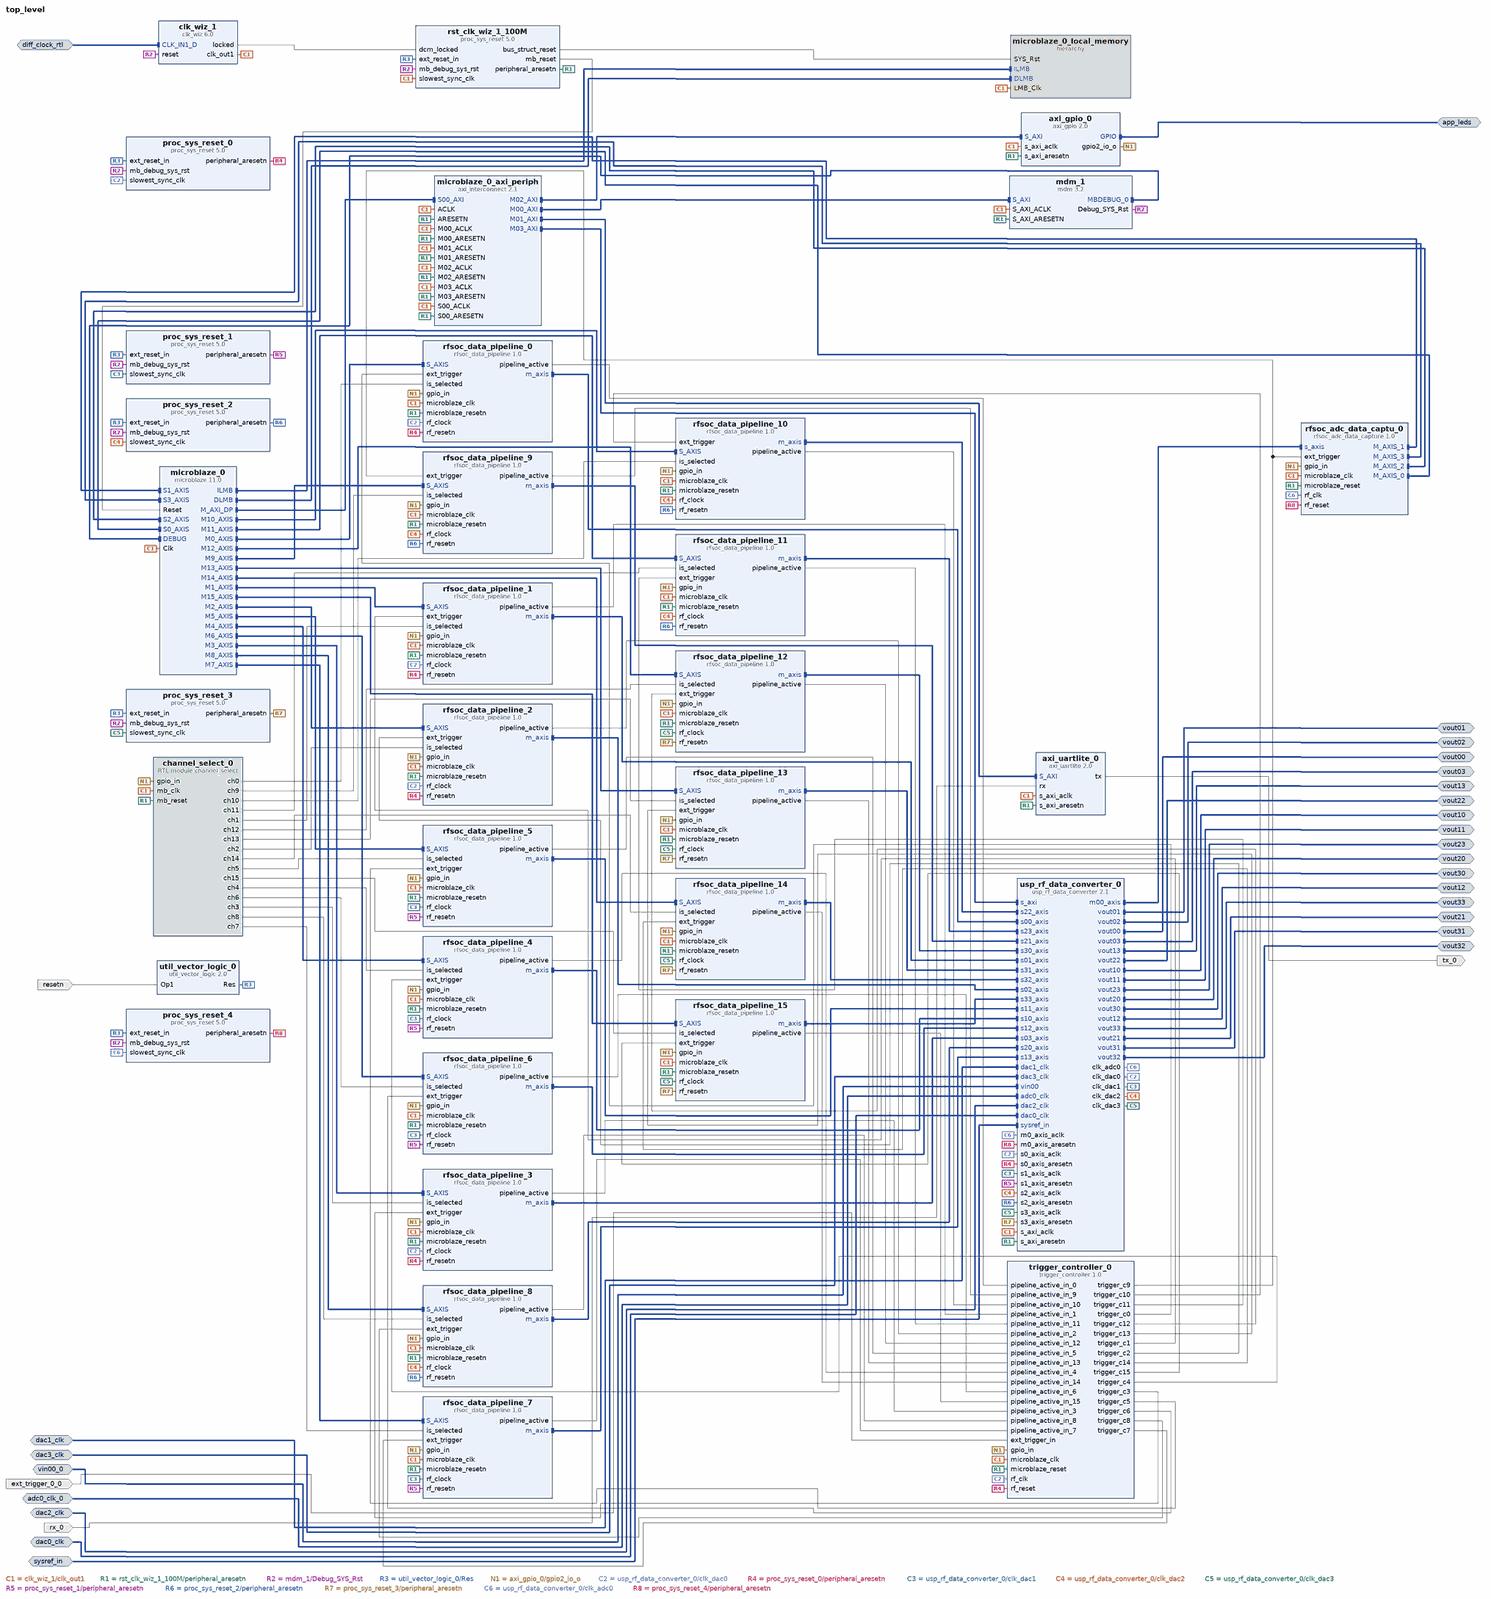
[diagram p0: block diagram of the top level, whole]
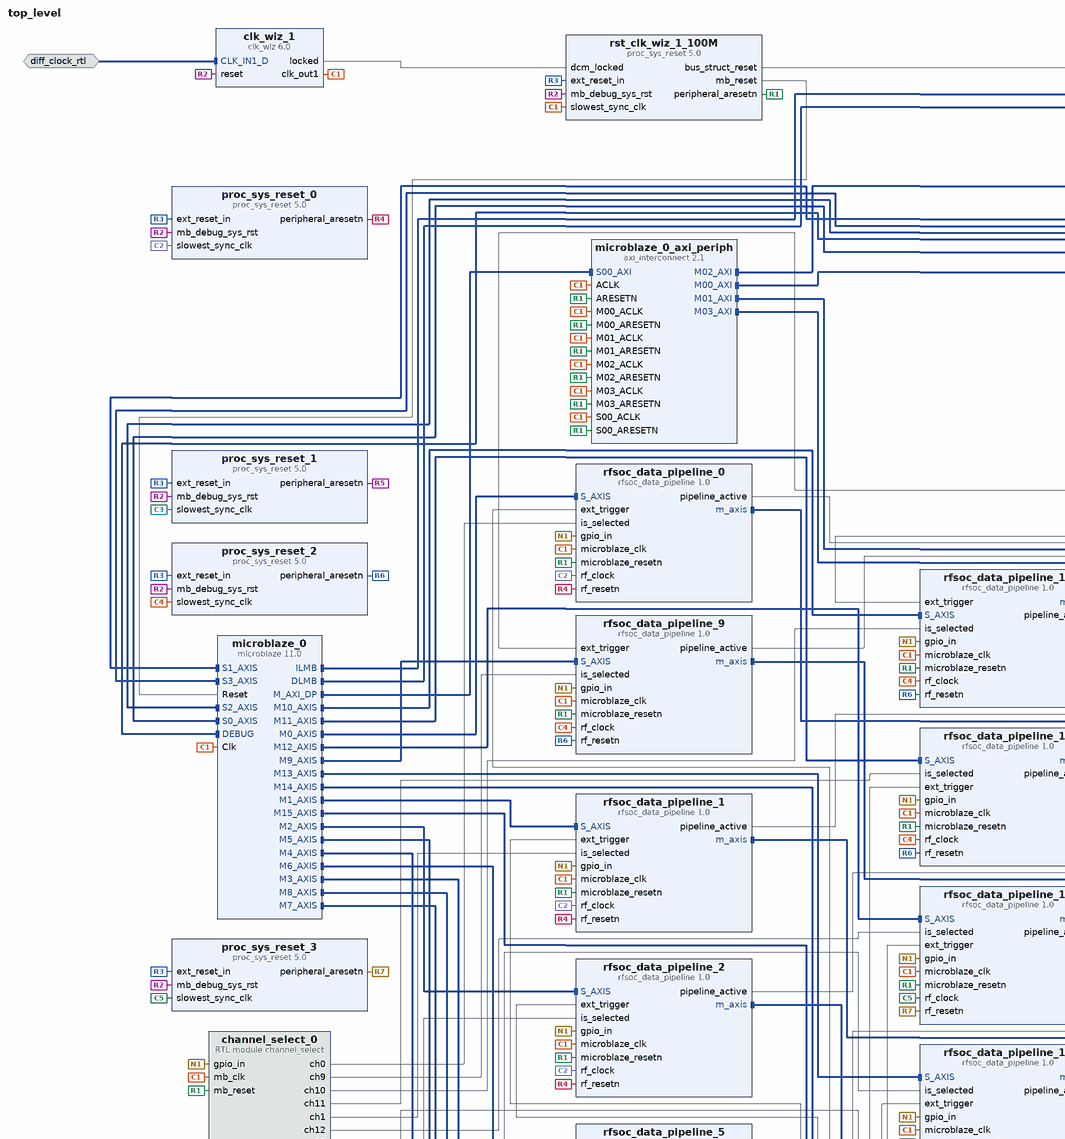
[diagram p1: block diagram of the top level, upper left part]
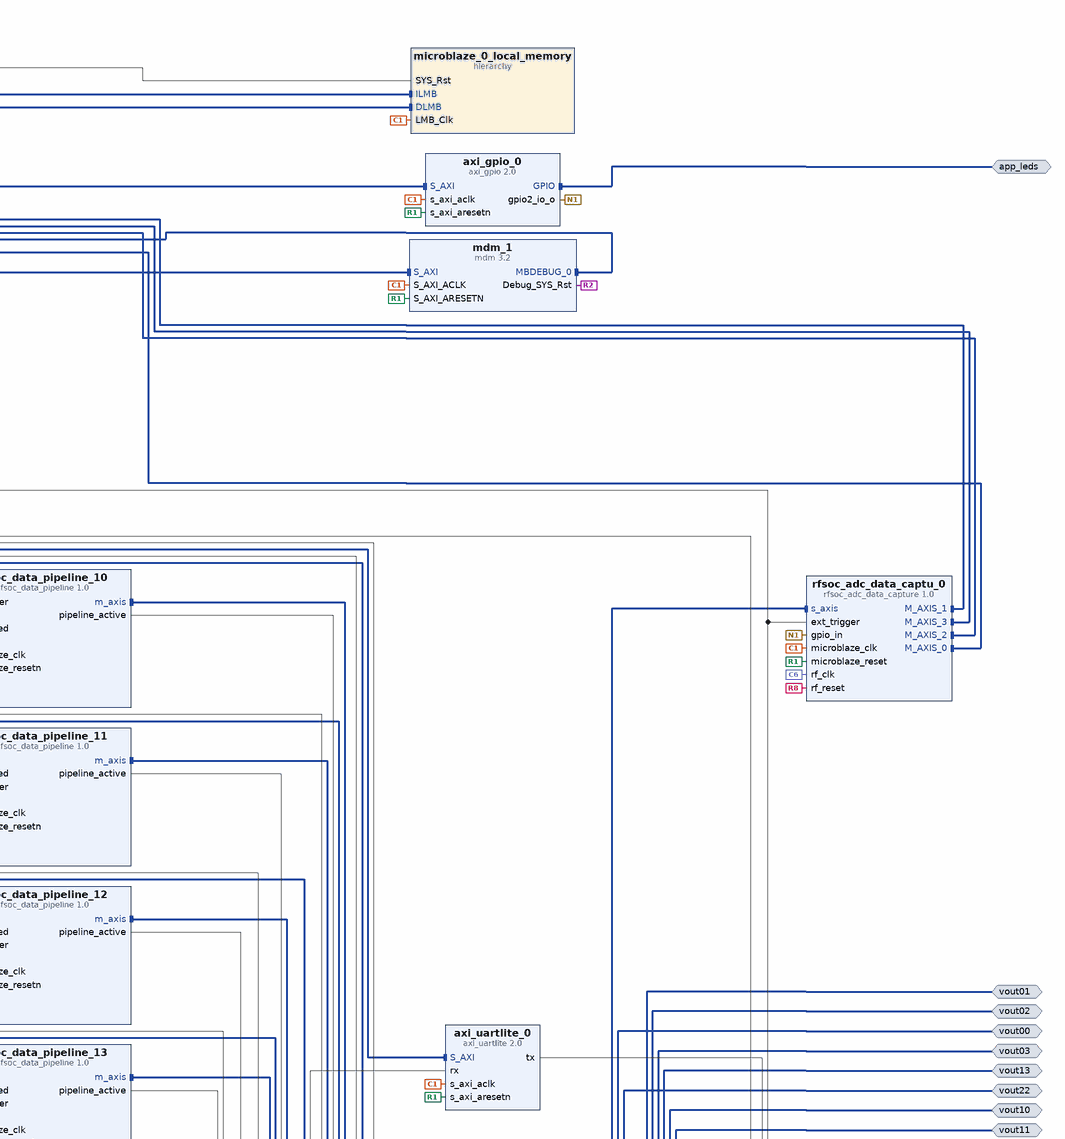
[diagram p2: block diagram of the top level, upper right part]
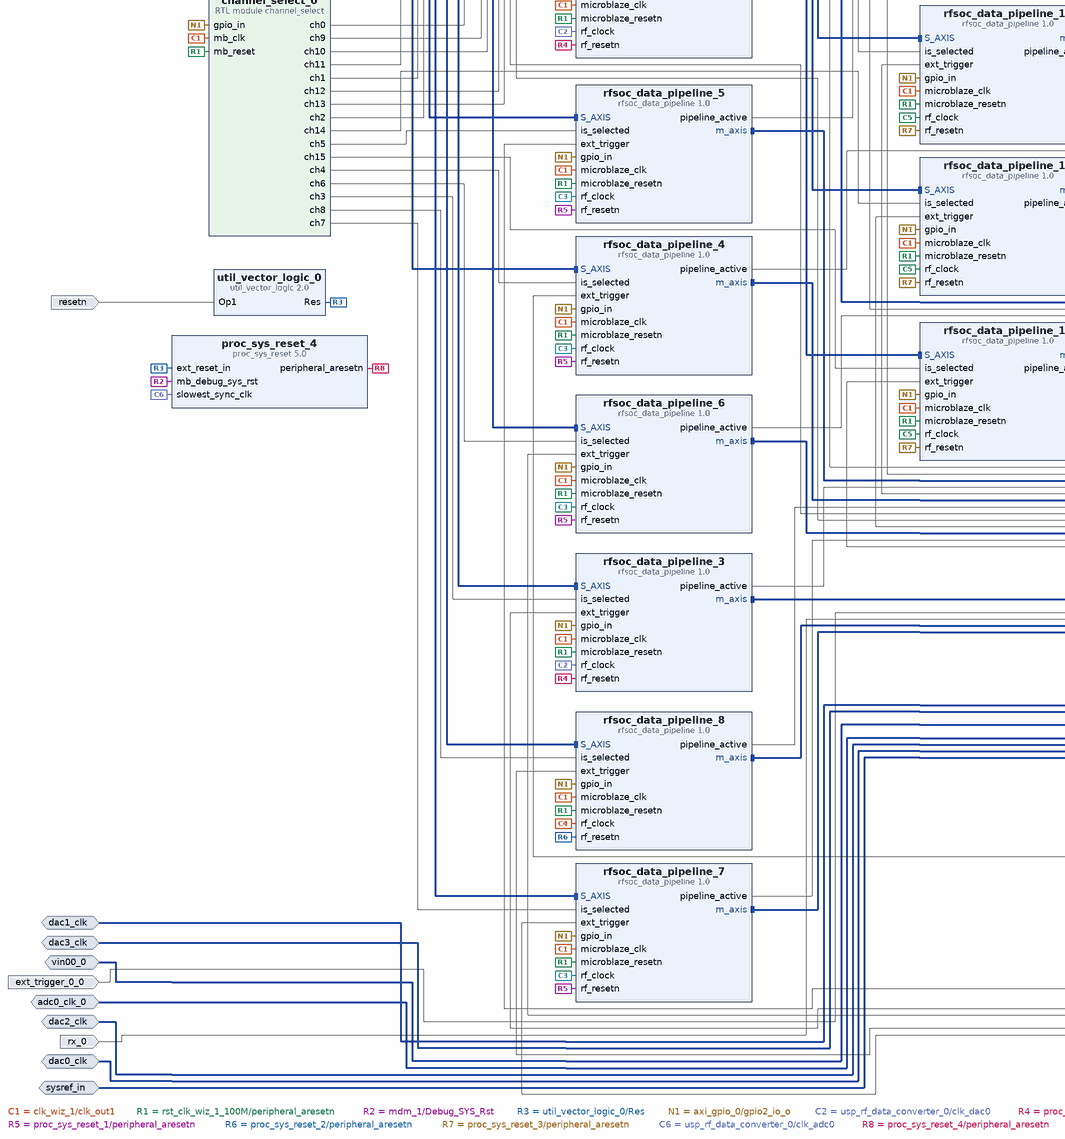
[diagram p3: block diagram of the top level, lower left part]
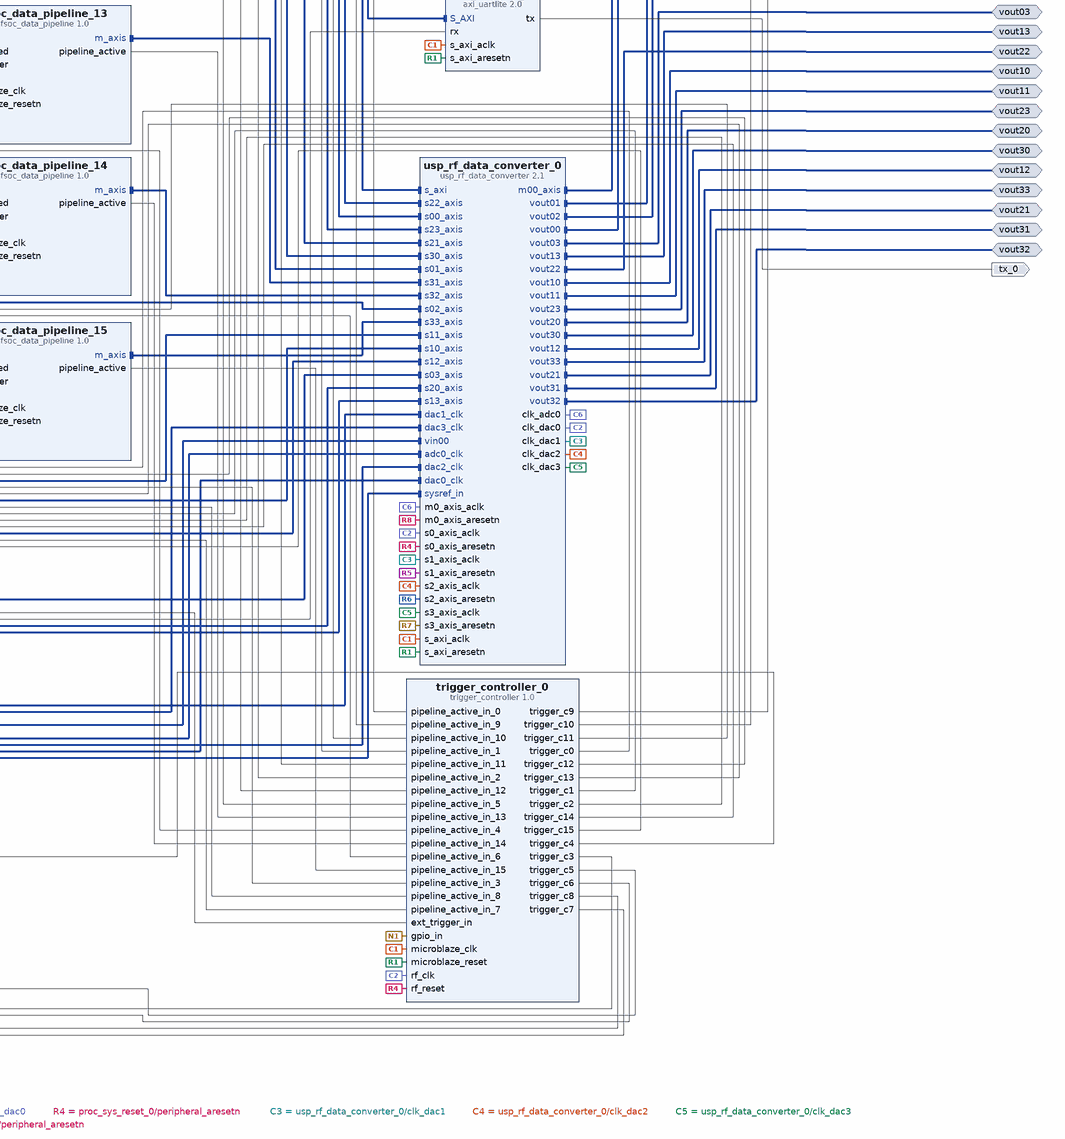
[diagram p4: block diagram of the top level, lower right part]
# Vivado block design top_level, xczu29dr-ffvf1760-2-e, Vivado 2019.1
create_bd_design top_level

create_bd_intf_port -mode Slave -vlnv xilinx.com:interface:diff_clock_rtl:1.0 diff_clock_rtl
set_property -dict {CONFIG.FREQ_HZ 300000000} [get_bd_intf_ports diff_clock_rtl]
create_bd_intf_port -mode Slave -vlnv xilinx.com:display_usp_rf_data_converter:diff_pins_rtl:1.0 sysref_in
create_bd_intf_port -mode Slave -vlnv xilinx.com:interface:diff_clock_rtl:1.0 dac0_clk
set_property -dict {CONFIG.FREQ_HZ 4000000000.0} [get_bd_intf_ports dac0_clk]
create_bd_intf_port -mode Master -vlnv xilinx.com:interface:diff_analog_io_rtl:1.0 vout00
create_bd_intf_port -mode Master -vlnv xilinx.com:interface:diff_analog_io_rtl:1.0 vout01
create_bd_intf_port -mode Master -vlnv xilinx.com:interface:diff_analog_io_rtl:1.0 vout02
create_bd_intf_port -mode Master -vlnv xilinx.com:interface:diff_analog_io_rtl:1.0 vout03
create_bd_intf_port -mode Master -vlnv xilinx.com:interface:gpio_rtl:1.0 app_leds
create_bd_intf_port -mode Slave -vlnv xilinx.com:interface:diff_clock_rtl:1.0 dac1_clk
set_property -dict {CONFIG.FREQ_HZ 250000000.0} [get_bd_intf_ports dac1_clk]
create_bd_intf_port -mode Master -vlnv xilinx.com:interface:diff_analog_io_rtl:1.0 vout10
create_bd_intf_port -mode Master -vlnv xilinx.com:interface:diff_analog_io_rtl:1.0 vout11
create_bd_intf_port -mode Master -vlnv xilinx.com:interface:diff_analog_io_rtl:1.0 vout12
create_bd_intf_port -mode Master -vlnv xilinx.com:interface:diff_analog_io_rtl:1.0 vout13
create_bd_intf_port -mode Slave -vlnv xilinx.com:interface:diff_clock_rtl:1.0 dac2_clk
set_property -dict {CONFIG.FREQ_HZ 250000000.0} [get_bd_intf_ports dac2_clk]
create_bd_intf_port -mode Master -vlnv xilinx.com:interface:diff_analog_io_rtl:1.0 vout20
create_bd_intf_port -mode Master -vlnv xilinx.com:interface:diff_analog_io_rtl:1.0 vout21
create_bd_intf_port -mode Master -vlnv xilinx.com:interface:diff_analog_io_rtl:1.0 vout22
create_bd_intf_port -mode Master -vlnv xilinx.com:interface:diff_analog_io_rtl:1.0 vout23
create_bd_intf_port -mode Slave -vlnv xilinx.com:interface:diff_clock_rtl:1.0 dac3_clk
set_property -dict {CONFIG.FREQ_HZ 250000000.0} [get_bd_intf_ports dac3_clk]
create_bd_intf_port -mode Master -vlnv xilinx.com:interface:diff_analog_io_rtl:1.0 vout30
create_bd_intf_port -mode Master -vlnv xilinx.com:interface:diff_analog_io_rtl:1.0 vout31
create_bd_intf_port -mode Master -vlnv xilinx.com:interface:diff_analog_io_rtl:1.0 vout32
create_bd_intf_port -mode Master -vlnv xilinx.com:interface:diff_analog_io_rtl:1.0 vout33
create_bd_intf_port -mode Slave -vlnv xilinx.com:interface:diff_analog_io_rtl:1.0 vin00_0
create_bd_intf_port -mode Slave -vlnv xilinx.com:interface:diff_clock_rtl:1.0 adc0_clk_0
create_bd_port -dir I -type rst resetn
set_property -dict {CONFIG.POLARITY ACTIVE_HIGH} [get_bd_ports resetn]
create_bd_port -dir I rx_0
create_bd_port -dir O tx_0
create_bd_port -dir I ext_trigger_0_0

create_bd_cell -type ip -vlnv xilinx.com:ip:microblaze:11.0 microblaze_0
set_property -dict [list \
  CONFIG.C_DEBUG_ENABLED 1 \
  CONFIG.C_D_AXI 1 \
  CONFIG.C_D_LMB 1 \
  CONFIG.C_FSL_LINKS 16 \
  CONFIG.C_I_LMB 1 \
  CONFIG.C_USE_EXTENDED_FSL_INSTR 1 \
] [get_bd_cells microblaze_0]
create_bd_cell -type hier microblaze_0_local_memory
create_bd_cell -type ip -vlnv xilinx.com:ip:axi_interconnect:2.1 microblaze_0_axi_periph
set_property -dict {CONFIG.NUM_MI 4} [get_bd_cells microblaze_0_axi_periph]
create_bd_cell -type ip -vlnv xilinx.com:ip:mdm:3.2 mdm_1
set_property -dict {CONFIG.C_ADDR_SIZE 32 CONFIG.C_M_AXI_ADDR_WIDTH 32 CONFIG.C_USE_UART 1} [get_bd_cells mdm_1]
create_bd_cell -type ip -vlnv xilinx.com:ip:clk_wiz:6.0 clk_wiz_1
set_property -dict [list \
  CONFIG.CLKIN1_JITTER_PS 33.330000000000005 \
  CONFIG.CLKOUT1_JITTER 101.475 \
  CONFIG.CLKOUT1_PHASE_ERROR 77.836 \
  CONFIG.MMCM_CLKFBOUT_MULT_F 4.000 \
  CONFIG.MMCM_CLKIN1_PERIOD 3.333 \
  CONFIG.MMCM_CLKIN2_PERIOD 10.0 \
  CONFIG.PRIM_IN_FREQ 300.000 \
  CONFIG.PRIM_SOURCE Differential_clock_capable_pin \
  CONFIG.USE_LOCKED true \
] [get_bd_cells clk_wiz_1]
create_bd_cell -type ip -vlnv xilinx.com:ip:proc_sys_reset:5.0 rst_clk_wiz_1_100M
create_bd_cell -type ip -vlnv xilinx.com:ip:util_vector_logic:2.0 util_vector_logic_0
set_property -dict {CONFIG.C_OPERATION not CONFIG.C_SIZE 1} [get_bd_cells util_vector_logic_0]
create_bd_cell -type ip -vlnv xilinx.com:ip:axi_uartlite:2.0 axi_uartlite_0
set_property -dict {CONFIG.C_BAUDRATE 230400} [get_bd_cells axi_uartlite_0]
create_bd_cell -type ip -vlnv xilinx.com:ip:axi_gpio:2.0 axi_gpio_0
set_property -dict [list \
  CONFIG.C_ALL_OUTPUTS_2 1 \
  CONFIG.C_GPIO2_WIDTH 16 \
  CONFIG.C_IS_DUAL 1 \
  CONFIG.GPIO2_BOARD_INTERFACE Custom \
  CONFIG.GPIO_BOARD_INTERFACE app_leds \
  CONFIG.USE_BOARD_FLOW true \
] [get_bd_cells axi_gpio_0]
create_bd_cell -type ip -vlnv xilinx.com:ip:usp_rf_data_converter:2.1 usp_rf_data_converter_0
set_property -dict [list \
  CONFIG.ADC0_PLL_Enable true \
  CONFIG.ADC0_Refclk_Freq 250.000 \
  CONFIG.ADC_Decimation_Mode00 1 \
  CONFIG.ADC_Dither00 true \
  CONFIG.ADC_Mixer_Type00 0 \
  CONFIG.ADC_Slice00_Enable true \
  CONFIG.DAC0_Outclk_Freq 250.000 \
  CONFIG.DAC0_PLL_Enable true \
  CONFIG.DAC0_Refclk_Freq 250.000 \
  CONFIG.DAC0_Sampling_Rate 4 \
  CONFIG.DAC1_Outclk_Freq 250.000 \
  CONFIG.DAC1_PLL_Enable true \
  CONFIG.DAC1_Refclk_Freq 250.000 \
  CONFIG.DAC1_Sampling_Rate 4 \
  CONFIG.DAC2_Outclk_Freq 250.000 \
  CONFIG.DAC2_PLL_Enable true \
  CONFIG.DAC2_Refclk_Freq 250.000 \
  CONFIG.DAC2_Sampling_Rate 4 \
  CONFIG.DAC3_Outclk_Freq 250.000 \
  CONFIG.DAC3_PLL_Enable true \
  CONFIG.DAC3_Refclk_Freq 250.000 \
  CONFIG.DAC3_Sampling_Rate 4 \
  CONFIG.DAC_Interpolation_Mode00 1 \
  CONFIG.DAC_Interpolation_Mode01 1 \
  CONFIG.DAC_Interpolation_Mode02 1 \
  CONFIG.DAC_Interpolation_Mode03 1 \
  CONFIG.DAC_Interpolation_Mode10 1 \
  CONFIG.DAC_Interpolation_Mode11 1 \
  CONFIG.DAC_Interpolation_Mode12 1 \
  CONFIG.DAC_Interpolation_Mode13 1 \
  CONFIG.DAC_Interpolation_Mode20 1 \
  CONFIG.DAC_Interpolation_Mode21 1 \
  CONFIG.DAC_Interpolation_Mode22 1 \
  CONFIG.DAC_Interpolation_Mode23 1 \
  CONFIG.DAC_Interpolation_Mode30 1 \
  CONFIG.DAC_Interpolation_Mode31 1 \
  CONFIG.DAC_Interpolation_Mode32 1 \
  CONFIG.DAC_Interpolation_Mode33 1 \
  CONFIG.DAC_Mixer_Type00 0 \
  CONFIG.DAC_Mixer_Type01 0 \
  CONFIG.DAC_Mixer_Type02 0 \
  CONFIG.DAC_Mixer_Type03 0 \
  CONFIG.DAC_Mixer_Type10 0 \
  CONFIG.DAC_Mixer_Type11 0 \
  CONFIG.DAC_Mixer_Type12 0 \
  CONFIG.DAC_Mixer_Type13 0 \
  CONFIG.DAC_Mixer_Type20 0 \
  CONFIG.DAC_Mixer_Type21 0 \
  CONFIG.DAC_Mixer_Type22 0 \
  CONFIG.DAC_Mixer_Type23 0 \
  CONFIG.DAC_Mixer_Type30 0 \
  CONFIG.DAC_Mixer_Type31 0 \
  CONFIG.DAC_Mixer_Type32 0 \
  CONFIG.DAC_Mixer_Type33 0 \
  CONFIG.DAC_Output_Current 1 \
  CONFIG.DAC_Slice00_Enable true \
  CONFIG.DAC_Slice01_Enable true \
  CONFIG.DAC_Slice02_Enable true \
  CONFIG.DAC_Slice03_Enable true \
  CONFIG.DAC_Slice10_Enable true \
  CONFIG.DAC_Slice11_Enable true \
  CONFIG.DAC_Slice12_Enable true \
  CONFIG.DAC_Slice13_Enable true \
  CONFIG.DAC_Slice20_Enable true \
  CONFIG.DAC_Slice21_Enable true \
  CONFIG.DAC_Slice22_Enable true \
  CONFIG.DAC_Slice23_Enable true \
  CONFIG.DAC_Slice30_Enable true \
  CONFIG.DAC_Slice31_Enable true \
  CONFIG.DAC_Slice32_Enable true \
  CONFIG.DAC_Slice33_Enable true \
] [get_bd_cells usp_rf_data_converter_0]
create_bd_cell -type ip -vlnv xilinx.com:ip:proc_sys_reset:5.0 proc_sys_reset_0
create_bd_cell -type ip -vlnv xilinx.com:ip:proc_sys_reset:5.0 proc_sys_reset_1
create_bd_cell -type ip -vlnv xilinx.com:ip:proc_sys_reset:5.0 proc_sys_reset_2
create_bd_cell -type ip -vlnv xilinx.com:ip:proc_sys_reset:5.0 proc_sys_reset_3
create_bd_cell -type ip -vlnv xilinx.com:ip:proc_sys_reset:5.0 proc_sys_reset_4
create_bd_cell -type module -reference channel_select channel_select_0
create_bd_cell -type ip -vlnv xilinx.com:user:rfsoc_data_pipeline:1.0 rfsoc_data_pipeline_0
create_bd_cell -type ip -vlnv xilinx.com:user:rfsoc_data_pipeline:1.0 rfsoc_data_pipeline_10
create_bd_cell -type ip -vlnv xilinx.com:user:rfsoc_data_pipeline:1.0 rfsoc_data_pipeline_11
create_bd_cell -type ip -vlnv xilinx.com:user:rfsoc_data_pipeline:1.0 rfsoc_data_pipeline_12
create_bd_cell -type ip -vlnv xilinx.com:user:rfsoc_data_pipeline:1.0 rfsoc_data_pipeline_13
create_bd_cell -type ip -vlnv xilinx.com:user:rfsoc_data_pipeline:1.0 rfsoc_data_pipeline_14
create_bd_cell -type ip -vlnv xilinx.com:user:rfsoc_data_pipeline:1.0 rfsoc_data_pipeline_15
create_bd_cell -type ip -vlnv xilinx.com:user:rfsoc_data_pipeline:1.0 rfsoc_data_pipeline_1
create_bd_cell -type ip -vlnv xilinx.com:user:rfsoc_data_pipeline:1.0 rfsoc_data_pipeline_2
create_bd_cell -type ip -vlnv xilinx.com:user:rfsoc_data_pipeline:1.0 rfsoc_data_pipeline_3
create_bd_cell -type ip -vlnv xilinx.com:user:rfsoc_data_pipeline:1.0 rfsoc_data_pipeline_4
create_bd_cell -type ip -vlnv xilinx.com:user:rfsoc_data_pipeline:1.0 rfsoc_data_pipeline_5
create_bd_cell -type ip -vlnv xilinx.com:user:rfsoc_data_pipeline:1.0 rfsoc_data_pipeline_6
create_bd_cell -type ip -vlnv xilinx.com:user:rfsoc_data_pipeline:1.0 rfsoc_data_pipeline_7
create_bd_cell -type ip -vlnv xilinx.com:user:rfsoc_data_pipeline:1.0 rfsoc_data_pipeline_8
create_bd_cell -type ip -vlnv xilinx.com:user:rfsoc_data_pipeline:1.0 rfsoc_data_pipeline_9
create_bd_cell -type ip -vlnv xilinx.com:user:trigger_controller:1.0 trigger_controller_0
create_bd_cell -type ip -vlnv xilinx.com:user:rfsoc_adc_data_capture:1.0 rfsoc_adc_data_captu_0

# ---- hierarchy /microblaze_0_local_memory ----
current_bd_instance /microblaze_0_local_memory
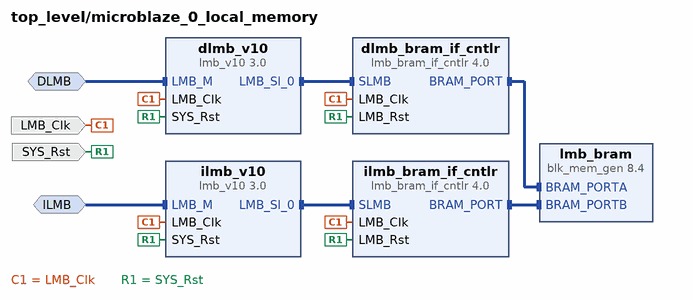
[diagram p5: block diagram inside /microblaze_0_local_memory]
create_bd_intf_pin -mode MirroredMaster -vlnv xilinx.com:interface:lmb_rtl:1.0 DLMB
create_bd_intf_pin -mode MirroredMaster -vlnv xilinx.com:interface:lmb_rtl:1.0 ILMB
create_bd_pin -dir I -type clk LMB_Clk
create_bd_pin -dir I -type rst SYS_Rst

create_bd_cell -type ip -vlnv xilinx.com:ip:lmb_v10:3.0 dlmb_v10
create_bd_cell -type ip -vlnv xilinx.com:ip:lmb_v10:3.0 ilmb_v10
create_bd_cell -type ip -vlnv xilinx.com:ip:lmb_bram_if_cntlr:4.0 dlmb_bram_if_cntlr
set_property -dict {CONFIG.C_ECC 0} [get_bd_cells dlmb_bram_if_cntlr]
create_bd_cell -type ip -vlnv xilinx.com:ip:lmb_bram_if_cntlr:4.0 ilmb_bram_if_cntlr
set_property -dict {CONFIG.C_ECC 0} [get_bd_cells ilmb_bram_if_cntlr]
create_bd_cell -type ip -vlnv xilinx.com:ip:blk_mem_gen:8.4 lmb_bram
set_property -dict {CONFIG.Memory_Type True_Dual_Port_RAM CONFIG.use_bram_block BRAM_Controller} [get_bd_cells lmb_bram]

# ---- connections ----

current_bd_instance /microblaze_0_local_memory
connect_bd_intf_net -intf_net microblaze_0_dlmb [get_bd_intf_pins DLMB] [get_bd_intf_pins dlmb_v10/LMB_M]
connect_bd_intf_net -intf_net microblaze_0_ilmb [get_bd_intf_pins ILMB] [get_bd_intf_pins ilmb_v10/LMB_M]
connect_bd_intf_net -intf_net microblaze_0_dlmb_bus [get_bd_intf_pins dlmb_v10/LMB_Sl_0] [get_bd_intf_pins dlmb_bram_if_cntlr/SLMB]
connect_bd_intf_net -intf_net microblaze_0_ilmb_bus [get_bd_intf_pins ilmb_v10/LMB_Sl_0] [get_bd_intf_pins ilmb_bram_if_cntlr/SLMB]
connect_bd_intf_net -intf_net microblaze_0_ilmb_cntlr [get_bd_intf_pins ilmb_bram_if_cntlr/BRAM_PORT] [get_bd_intf_pins lmb_bram/BRAM_PORTB]
connect_bd_intf_net -intf_net microblaze_0_dlmb_cntlr [get_bd_intf_pins dlmb_bram_if_cntlr/BRAM_PORT] [get_bd_intf_pins lmb_bram/BRAM_PORTA]
connect_bd_net -net microblaze_0_Clk [get_bd_pins LMB_Clk] \
  [get_bd_pins dlmb_v10/LMB_Clk] [get_bd_pins dlmb_bram_if_cntlr/LMB_Clk] [get_bd_pins ilmb_v10/LMB_Clk] \
  [get_bd_pins ilmb_bram_if_cntlr/LMB_Clk]
connect_bd_net [get_bd_pins SYS_Rst] \
  [get_bd_pins dlmb_v10/SYS_Rst] [get_bd_pins dlmb_bram_if_cntlr/LMB_Rst] [get_bd_pins ilmb_v10/SYS_Rst] \
  [get_bd_pins ilmb_bram_if_cntlr/LMB_Rst]
set_property HDL_ATTRIBUTE.BMM_INFO_ADDRESS_SPACE {byte  0x00000000 32 > top_level microblaze_0_local_memory/lmb_bram} [get_bd_cells dlmb_bram_if_cntlr]
set_property HDL_ATTRIBUTE.KEEP_HIERARCHY yes [get_bd_cells dlmb_bram_if_cntlr]

current_bd_instance /
connect_bd_intf_net [get_bd_intf_ports vout22] [get_bd_intf_pins usp_rf_data_converter_0/vout22]
connect_bd_intf_net [get_bd_intf_pins microblaze_0/M10_AXIS] [get_bd_intf_pins rfsoc_data_pipeline_10/S_AXIS]
connect_bd_intf_net [get_bd_intf_pins rfsoc_data_pipeline_7/S_AXIS] [get_bd_intf_pins microblaze_0/M7_AXIS]
connect_bd_intf_net [get_bd_intf_pins microblaze_0/ILMB] [get_bd_intf_pins microblaze_0_local_memory/ILMB]
connect_bd_intf_net [get_bd_intf_ports dac1_clk] [get_bd_intf_pins usp_rf_data_converter_0/dac1_clk]
connect_bd_intf_net [get_bd_intf_pins rfsoc_data_pipeline_0/m_axis] [get_bd_intf_pins usp_rf_data_converter_0/s00_axis]
connect_bd_intf_net [get_bd_intf_ports vout02] [get_bd_intf_pins usp_rf_data_converter_0/vout02]
connect_bd_intf_net [get_bd_intf_ports vout01] [get_bd_intf_pins usp_rf_data_converter_0/vout01]
connect_bd_intf_net [get_bd_intf_pins microblaze_0/M9_AXIS] [get_bd_intf_pins rfsoc_data_pipeline_9/S_AXIS]
connect_bd_intf_net [get_bd_intf_pins rfsoc_data_pipeline_14/S_AXIS] [get_bd_intf_pins microblaze_0/M14_AXIS]
connect_bd_intf_net [get_bd_intf_pins microblaze_0/M1_AXIS] [get_bd_intf_pins rfsoc_data_pipeline_1/S_AXIS]
connect_bd_intf_net [get_bd_intf_pins microblaze_0/DLMB] [get_bd_intf_pins microblaze_0_local_memory/DLMB]
connect_bd_intf_net [get_bd_intf_ports dac3_clk] [get_bd_intf_pins usp_rf_data_converter_0/dac3_clk]
connect_bd_intf_net [get_bd_intf_pins rfsoc_data_pipeline_1/m_axis] [get_bd_intf_pins usp_rf_data_converter_0/s01_axis]
connect_bd_intf_net [get_bd_intf_pins rfsoc_data_pipeline_15/S_AXIS] [get_bd_intf_pins microblaze_0/M15_AXIS]
connect_bd_intf_net -intf_net vin00_0_1 [get_bd_intf_ports vin00_0] [get_bd_intf_pins usp_rf_data_converter_0/vin00]
connect_bd_intf_net [get_bd_intf_pins microblaze_0_axi_periph/M02_AXI] [get_bd_intf_pins axi_gpio_0/S_AXI]
connect_bd_intf_net [get_bd_intf_pins rfsoc_data_pipeline_13/m_axis] [get_bd_intf_pins usp_rf_data_converter_0/s31_axis]
connect_bd_intf_net [get_bd_intf_pins rfsoc_data_pipeline_6/m_axis] [get_bd_intf_pins usp_rf_data_converter_0/s12_axis]
connect_bd_intf_net [get_bd_intf_ports vout13] [get_bd_intf_pins usp_rf_data_converter_0/vout13]
connect_bd_intf_net -intf_net adc0_clk_0_1 [get_bd_intf_ports adc0_clk_0] [get_bd_intf_pins usp_rf_data_converter_0/adc0_clk]
connect_bd_intf_net [get_bd_intf_pins rfsoc_adc_data_captu_0/M_AXIS_1] [get_bd_intf_pins microblaze_0/S1_AXIS]
connect_bd_intf_net [get_bd_intf_pins rfsoc_data_pipeline_12/m_axis] [get_bd_intf_pins usp_rf_data_converter_0/s30_axis]
connect_bd_intf_net -intf_net microblaze_0_axi_dp [get_bd_intf_pins microblaze_0_axi_periph/S00_AXI] [get_bd_intf_pins microblaze_0/M_AXI_DP]
connect_bd_intf_net [get_bd_intf_ports vout23] [get_bd_intf_pins usp_rf_data_converter_0/vout23]
connect_bd_intf_net [get_bd_intf_ports vout03] [get_bd_intf_pins usp_rf_data_converter_0/vout03]
connect_bd_intf_net [get_bd_intf_pins microblaze_0/M6_AXIS] [get_bd_intf_pins rfsoc_data_pipeline_6/S_AXIS]
connect_bd_intf_net [get_bd_intf_pins microblaze_0/M12_AXIS] [get_bd_intf_pins rfsoc_data_pipeline_12/S_AXIS]
connect_bd_intf_net [get_bd_intf_pins rfsoc_data_pipeline_5/m_axis] [get_bd_intf_pins usp_rf_data_converter_0/s11_axis]
connect_bd_intf_net [get_bd_intf_ports vout30] [get_bd_intf_pins usp_rf_data_converter_0/vout30]
connect_bd_intf_net [get_bd_intf_pins microblaze_0_axi_periph/M03_AXI] [get_bd_intf_pins usp_rf_data_converter_0/s_axi]
connect_bd_intf_net [get_bd_intf_ports dac2_clk] [get_bd_intf_pins usp_rf_data_converter_0/dac2_clk]
connect_bd_intf_net [get_bd_intf_pins rfsoc_data_pipeline_10/m_axis] [get_bd_intf_pins usp_rf_data_converter_0/s22_axis]
connect_bd_intf_net [get_bd_intf_ports dac0_clk] [get_bd_intf_pins usp_rf_data_converter_0/dac0_clk]
connect_bd_intf_net [get_bd_intf_pins microblaze_0/M11_AXIS] [get_bd_intf_pins rfsoc_data_pipeline_11/S_AXIS]
connect_bd_intf_net [get_bd_intf_pins rfsoc_adc_data_captu_0/M_AXIS_3] [get_bd_intf_pins microblaze_0/S3_AXIS]
connect_bd_intf_net [get_bd_intf_ports vout33] [get_bd_intf_pins usp_rf_data_converter_0/vout33]
connect_bd_intf_net [get_bd_intf_pins microblaze_0/M13_AXIS] [get_bd_intf_pins rfsoc_data_pipeline_13/S_AXIS]
connect_bd_intf_net [get_bd_intf_pins rfsoc_data_pipeline_15/m_axis] [get_bd_intf_pins usp_rf_data_converter_0/s33_axis]
connect_bd_intf_net [get_bd_intf_pins rfsoc_data_pipeline_5/S_AXIS] [get_bd_intf_pins microblaze_0/M5_AXIS]
connect_bd_intf_net [get_bd_intf_pins rfsoc_data_pipeline_11/m_axis] [get_bd_intf_pins usp_rf_data_converter_0/s23_axis]
connect_bd_intf_net [get_bd_intf_pins rfsoc_data_pipeline_14/m_axis] [get_bd_intf_pins usp_rf_data_converter_0/s32_axis]
connect_bd_intf_net [get_bd_intf_ports diff_clock_rtl] [get_bd_intf_pins clk_wiz_1/CLK_IN1_D]
connect_bd_intf_net [get_bd_intf_pins microblaze_0/M2_AXIS] [get_bd_intf_pins rfsoc_data_pipeline_2/S_AXIS]
connect_bd_intf_net [get_bd_intf_pins rfsoc_data_pipeline_4/S_AXIS] [get_bd_intf_pins microblaze_0/M4_AXIS]
connect_bd_intf_net [get_bd_intf_pins rfsoc_data_pipeline_8/m_axis] [get_bd_intf_pins usp_rf_data_converter_0/s20_axis]
connect_bd_intf_net [get_bd_intf_ports vout00] [get_bd_intf_pins usp_rf_data_converter_0/vout00]
connect_bd_intf_net [get_bd_intf_pins microblaze_0/M0_AXIS] [get_bd_intf_pins rfsoc_data_pipeline_0/S_AXIS]
connect_bd_intf_net [get_bd_intf_pins rfsoc_data_pipeline_8/S_AXIS] [get_bd_intf_pins microblaze_0/M8_AXIS]
connect_bd_intf_net [get_bd_intf_pins rfsoc_data_pipeline_4/m_axis] [get_bd_intf_pins usp_rf_data_converter_0/s10_axis]
connect_bd_intf_net [get_bd_intf_pins mdm_1/MBDEBUG_0] [get_bd_intf_pins microblaze_0/DEBUG]
connect_bd_intf_net [get_bd_intf_pins microblaze_0_axi_periph/M01_AXI] [get_bd_intf_pins axi_uartlite_0/S_AXI]
connect_bd_intf_net [get_bd_intf_ports vout10] [get_bd_intf_pins usp_rf_data_converter_0/vout10]
connect_bd_intf_net [get_bd_intf_pins microblaze_0/M3_AXIS] [get_bd_intf_pins rfsoc_data_pipeline_3/S_AXIS]
connect_bd_intf_net [get_bd_intf_ports vout11] [get_bd_intf_pins usp_rf_data_converter_0/vout11]
connect_bd_intf_net [get_bd_intf_pins rfsoc_data_pipeline_9/m_axis] [get_bd_intf_pins usp_rf_data_converter_0/s21_axis]
connect_bd_intf_net [get_bd_intf_pins rfsoc_data_pipeline_7/m_axis] [get_bd_intf_pins usp_rf_data_converter_0/s13_axis]
connect_bd_intf_net -intf_net microblaze_0_mdm_axi [get_bd_intf_pins microblaze_0_axi_periph/M00_AXI] [get_bd_intf_pins mdm_1/S_AXI]
connect_bd_intf_net [get_bd_intf_pins rfsoc_adc_data_captu_0/s_axis] [get_bd_intf_pins usp_rf_data_converter_0/m00_axis]
connect_bd_intf_net [get_bd_intf_ports vout20] [get_bd_intf_pins usp_rf_data_converter_0/vout20]
connect_bd_intf_net [get_bd_intf_ports vout31] [get_bd_intf_pins usp_rf_data_converter_0/vout31]
connect_bd_intf_net [get_bd_intf_ports vout12] [get_bd_intf_pins usp_rf_data_converter_0/vout12]
connect_bd_intf_net [get_bd_intf_ports app_leds] [get_bd_intf_pins axi_gpio_0/GPIO]
connect_bd_intf_net [get_bd_intf_pins rfsoc_adc_data_captu_0/M_AXIS_2] [get_bd_intf_pins microblaze_0/S2_AXIS]
connect_bd_intf_net [get_bd_intf_ports sysref_in] [get_bd_intf_pins usp_rf_data_converter_0/sysref_in]
connect_bd_intf_net [get_bd_intf_pins rfsoc_adc_data_captu_0/M_AXIS_0] [get_bd_intf_pins microblaze_0/S0_AXIS]
connect_bd_intf_net [get_bd_intf_pins rfsoc_data_pipeline_2/m_axis] [get_bd_intf_pins usp_rf_data_converter_0/s02_axis]
connect_bd_intf_net [get_bd_intf_ports vout32] [get_bd_intf_pins usp_rf_data_converter_0/vout32]
connect_bd_intf_net [get_bd_intf_ports vout21] [get_bd_intf_pins usp_rf_data_converter_0/vout21]
connect_bd_intf_net [get_bd_intf_pins rfsoc_data_pipeline_3/m_axis] [get_bd_intf_pins usp_rf_data_converter_0/s03_axis]
connect_bd_net -net microblaze_0_Clk [get_bd_pins clk_wiz_1/clk_out1] \
  [get_bd_pins microblaze_0/Clk] [get_bd_pins microblaze_0_axi_periph/ACLK] [get_bd_pins microblaze_0_axi_periph/S00_ACLK] \
  [get_bd_pins microblaze_0_axi_periph/M00_ACLK] [get_bd_pins microblaze_0_local_memory/LMB_Clk] \
  [get_bd_pins mdm_1/S_AXI_ACLK] [get_bd_pins rst_clk_wiz_1_100M/slowest_sync_clk] [get_bd_pins axi_uartlite_0/s_axi_aclk] \
  [get_bd_pins microblaze_0_axi_periph/M01_ACLK] [get_bd_pins axi_gpio_0/s_axi_aclk] \
  [get_bd_pins microblaze_0_axi_periph/M02_ACLK] [get_bd_pins usp_rf_data_converter_0/s_axi_aclk] \
  [get_bd_pins microblaze_0_axi_periph/M03_ACLK] [get_bd_pins channel_select_0/mb_clk] \
  [get_bd_pins rfsoc_data_pipeline_0/microblaze_clk] [get_bd_pins rfsoc_data_pipeline_10/microblaze_clk] \
  [get_bd_pins rfsoc_data_pipeline_11/microblaze_clk] [get_bd_pins rfsoc_data_pipeline_12/microblaze_clk] \
  [get_bd_pins rfsoc_data_pipeline_13/microblaze_clk] [get_bd_pins rfsoc_data_pipeline_14/microblaze_clk] \
  [get_bd_pins rfsoc_data_pipeline_15/microblaze_clk] [get_bd_pins rfsoc_data_pipeline_1/microblaze_clk] \
  [get_bd_pins rfsoc_data_pipeline_2/microblaze_clk] [get_bd_pins rfsoc_data_pipeline_3/microblaze_clk] \
  [get_bd_pins rfsoc_data_pipeline_4/microblaze_clk] [get_bd_pins rfsoc_data_pipeline_5/microblaze_clk] \
  [get_bd_pins rfsoc_data_pipeline_6/microblaze_clk] [get_bd_pins rfsoc_data_pipeline_7/microblaze_clk] \
  [get_bd_pins rfsoc_data_pipeline_8/microblaze_clk] [get_bd_pins rfsoc_data_pipeline_9/microblaze_clk] \
  [get_bd_pins trigger_controller_0/microblaze_clk] [get_bd_pins rfsoc_adc_data_captu_0/microblaze_clk]
connect_bd_net [get_bd_pins rst_clk_wiz_1_100M/mb_reset] [get_bd_pins microblaze_0/Reset]
connect_bd_net [get_bd_pins rst_clk_wiz_1_100M/bus_struct_reset] [get_bd_pins microblaze_0_local_memory/SYS_Rst]
connect_bd_net [get_bd_pins rst_clk_wiz_1_100M/peripheral_aresetn] \
  [get_bd_pins microblaze_0_axi_periph/ARESETN] [get_bd_pins microblaze_0_axi_periph/S00_ARESETN] \
  [get_bd_pins microblaze_0_axi_periph/M00_ARESETN] [get_bd_pins mdm_1/S_AXI_ARESETN] \
  [get_bd_pins axi_uartlite_0/s_axi_aresetn] [get_bd_pins microblaze_0_axi_periph/M01_ARESETN] \
  [get_bd_pins axi_gpio_0/s_axi_aresetn] [get_bd_pins microblaze_0_axi_periph/M02_ARESETN] \
  [get_bd_pins usp_rf_data_converter_0/s_axi_aresetn] [get_bd_pins microblaze_0_axi_periph/M03_ARESETN] \
  [get_bd_pins channel_select_0/mb_reset] [get_bd_pins rfsoc_data_pipeline_0/microblaze_resetn] \
  [get_bd_pins rfsoc_data_pipeline_10/microblaze_resetn] [get_bd_pins rfsoc_data_pipeline_11/microblaze_resetn] \
  [get_bd_pins rfsoc_data_pipeline_12/microblaze_resetn] [get_bd_pins rfsoc_data_pipeline_13/microblaze_resetn] \
  [get_bd_pins rfsoc_data_pipeline_14/microblaze_resetn] [get_bd_pins rfsoc_data_pipeline_15/microblaze_resetn] \
  [get_bd_pins rfsoc_data_pipeline_1/microblaze_resetn] [get_bd_pins rfsoc_data_pipeline_2/microblaze_resetn] \
  [get_bd_pins rfsoc_data_pipeline_3/microblaze_resetn] [get_bd_pins rfsoc_data_pipeline_4/microblaze_resetn] \
  [get_bd_pins rfsoc_data_pipeline_5/microblaze_resetn] [get_bd_pins rfsoc_data_pipeline_6/microblaze_resetn] \
  [get_bd_pins rfsoc_data_pipeline_7/microblaze_resetn] [get_bd_pins rfsoc_data_pipeline_8/microblaze_resetn] \
  [get_bd_pins rfsoc_data_pipeline_9/microblaze_resetn] [get_bd_pins trigger_controller_0/microblaze_reset] \
  [get_bd_pins rfsoc_adc_data_captu_0/microblaze_reset]
connect_bd_net [get_bd_pins mdm_1/Debug_SYS_Rst] \
  [get_bd_pins rst_clk_wiz_1_100M/mb_debug_sys_rst] [get_bd_pins clk_wiz_1/reset] \
  [get_bd_pins proc_sys_reset_0/mb_debug_sys_rst] [get_bd_pins proc_sys_reset_1/mb_debug_sys_rst] \
  [get_bd_pins proc_sys_reset_2/mb_debug_sys_rst] [get_bd_pins proc_sys_reset_3/mb_debug_sys_rst] \
  [get_bd_pins proc_sys_reset_4/mb_debug_sys_rst]
connect_bd_net [get_bd_pins clk_wiz_1/locked] [get_bd_pins rst_clk_wiz_1_100M/dcm_locked]
connect_bd_net [get_bd_ports resetn] [get_bd_pins util_vector_logic_0/Op1]
connect_bd_net [get_bd_pins util_vector_logic_0/Res] \
  [get_bd_pins rst_clk_wiz_1_100M/ext_reset_in] [get_bd_pins proc_sys_reset_0/ext_reset_in] \
  [get_bd_pins proc_sys_reset_1/ext_reset_in] [get_bd_pins proc_sys_reset_2/ext_reset_in] \
  [get_bd_pins proc_sys_reset_3/ext_reset_in] [get_bd_pins proc_sys_reset_4/ext_reset_in]
connect_bd_net -net rx_0_1 [get_bd_ports rx_0] [get_bd_pins axi_uartlite_0/rx]
connect_bd_net [get_bd_pins axi_uartlite_0/tx] [get_bd_ports tx_0]
connect_bd_net [get_bd_pins axi_gpio_0/gpio2_io_o] \
  [get_bd_pins channel_select_0/gpio_in] [get_bd_pins rfsoc_data_pipeline_0/gpio_in] \
  [get_bd_pins rfsoc_data_pipeline_10/gpio_in] [get_bd_pins rfsoc_data_pipeline_11/gpio_in] \
  [get_bd_pins rfsoc_data_pipeline_12/gpio_in] [get_bd_pins rfsoc_data_pipeline_13/gpio_in] \
  [get_bd_pins rfsoc_data_pipeline_14/gpio_in] [get_bd_pins rfsoc_data_pipeline_15/gpio_in] \
  [get_bd_pins rfsoc_data_pipeline_1/gpio_in] [get_bd_pins rfsoc_data_pipeline_2/gpio_in] \
  [get_bd_pins rfsoc_data_pipeline_3/gpio_in] [get_bd_pins rfsoc_data_pipeline_4/gpio_in] \
  [get_bd_pins rfsoc_data_pipeline_5/gpio_in] [get_bd_pins rfsoc_data_pipeline_6/gpio_in] \
  [get_bd_pins rfsoc_data_pipeline_7/gpio_in] [get_bd_pins rfsoc_data_pipeline_8/gpio_in] \
  [get_bd_pins rfsoc_data_pipeline_9/gpio_in] [get_bd_pins trigger_controller_0/gpio_in] \
  [get_bd_pins rfsoc_adc_data_captu_0/gpio_in]
connect_bd_net [get_bd_pins usp_rf_data_converter_0/clk_dac0] \
  [get_bd_pins usp_rf_data_converter_0/s0_axis_aclk] [get_bd_pins proc_sys_reset_0/slowest_sync_clk] \
  [get_bd_pins rfsoc_data_pipeline_0/rf_clock] [get_bd_pins rfsoc_data_pipeline_1/rf_clock] \
  [get_bd_pins rfsoc_data_pipeline_2/rf_clock] [get_bd_pins rfsoc_data_pipeline_3/rf_clock] \
  [get_bd_pins trigger_controller_0/rf_clk]
connect_bd_net [get_bd_pins proc_sys_reset_0/peripheral_aresetn] \
  [get_bd_pins usp_rf_data_converter_0/s0_axis_aresetn] [get_bd_pins rfsoc_data_pipeline_0/rf_resetn] \
  [get_bd_pins rfsoc_data_pipeline_1/rf_resetn] [get_bd_pins rfsoc_data_pipeline_2/rf_resetn] \
  [get_bd_pins rfsoc_data_pipeline_3/rf_resetn] [get_bd_pins trigger_controller_0/rf_reset]
connect_bd_net [get_bd_pins rfsoc_data_pipeline_1/pipeline_active] [get_bd_pins trigger_controller_0/pipeline_active_in_1]
connect_bd_net [get_bd_pins rfsoc_data_pipeline_0/pipeline_active] [get_bd_pins trigger_controller_0/pipeline_active_in_0]
connect_bd_net [get_bd_pins usp_rf_data_converter_0/clk_dac1] \
  [get_bd_pins usp_rf_data_converter_0/s1_axis_aclk] [get_bd_pins proc_sys_reset_1/slowest_sync_clk] \
  [get_bd_pins rfsoc_data_pipeline_4/rf_clock] [get_bd_pins rfsoc_data_pipeline_5/rf_clock] \
  [get_bd_pins rfsoc_data_pipeline_6/rf_clock] [get_bd_pins rfsoc_data_pipeline_7/rf_clock]
connect_bd_net [get_bd_pins usp_rf_data_converter_0/clk_dac2] \
  [get_bd_pins usp_rf_data_converter_0/s2_axis_aclk] [get_bd_pins proc_sys_reset_2/slowest_sync_clk] \
  [get_bd_pins rfsoc_data_pipeline_10/rf_clock] [get_bd_pins rfsoc_data_pipeline_11/rf_clock] \
  [get_bd_pins rfsoc_data_pipeline_8/rf_clock] [get_bd_pins rfsoc_data_pipeline_9/rf_clock]
connect_bd_net [get_bd_pins usp_rf_data_converter_0/clk_dac3] \
  [get_bd_pins usp_rf_data_converter_0/s3_axis_aclk] [get_bd_pins proc_sys_reset_3/slowest_sync_clk] \
  [get_bd_pins rfsoc_data_pipeline_12/rf_clock] [get_bd_pins rfsoc_data_pipeline_13/rf_clock] \
  [get_bd_pins rfsoc_data_pipeline_14/rf_clock] [get_bd_pins rfsoc_data_pipeline_15/rf_clock]
connect_bd_net [get_bd_pins proc_sys_reset_1/peripheral_aresetn] \
  [get_bd_pins usp_rf_data_converter_0/s1_axis_aresetn] [get_bd_pins rfsoc_data_pipeline_4/rf_resetn] \
  [get_bd_pins rfsoc_data_pipeline_5/rf_resetn] [get_bd_pins rfsoc_data_pipeline_6/rf_resetn] \
  [get_bd_pins rfsoc_data_pipeline_7/rf_resetn]
connect_bd_net [get_bd_pins proc_sys_reset_2/peripheral_aresetn] \
  [get_bd_pins usp_rf_data_converter_0/s2_axis_aresetn] [get_bd_pins rfsoc_data_pipeline_10/rf_resetn] \
  [get_bd_pins rfsoc_data_pipeline_11/rf_resetn] [get_bd_pins rfsoc_data_pipeline_8/rf_resetn] \
  [get_bd_pins rfsoc_data_pipeline_9/rf_resetn]
connect_bd_net [get_bd_pins proc_sys_reset_3/peripheral_aresetn] \
  [get_bd_pins usp_rf_data_converter_0/s3_axis_aresetn] [get_bd_pins rfsoc_data_pipeline_12/rf_resetn] \
  [get_bd_pins rfsoc_data_pipeline_13/rf_resetn] [get_bd_pins rfsoc_data_pipeline_14/rf_resetn] \
  [get_bd_pins rfsoc_data_pipeline_15/rf_resetn]
connect_bd_net [get_bd_pins channel_select_0/ch9] [get_bd_pins rfsoc_data_pipeline_9/is_selected]
connect_bd_net [get_bd_pins channel_select_0/ch5] [get_bd_pins rfsoc_data_pipeline_5/is_selected]
connect_bd_net [get_bd_pins channel_select_0/ch4] [get_bd_pins rfsoc_data_pipeline_4/is_selected]
connect_bd_net [get_bd_pins channel_select_0/ch3] [get_bd_pins rfsoc_data_pipeline_3/is_selected]
connect_bd_net [get_bd_pins channel_select_0/ch15] [get_bd_pins rfsoc_data_pipeline_15/is_selected]
connect_bd_net [get_bd_pins channel_select_0/ch14] [get_bd_pins rfsoc_data_pipeline_14/is_selected]
connect_bd_net [get_bd_pins channel_select_0/ch13] [get_bd_pins rfsoc_data_pipeline_13/is_selected]
connect_bd_net [get_bd_pins channel_select_0/ch10] [get_bd_pins rfsoc_data_pipeline_10/is_selected]
connect_bd_net [get_bd_pins channel_select_0/ch7] [get_bd_pins rfsoc_data_pipeline_7/is_selected]
connect_bd_net [get_bd_pins channel_select_0/ch6] [get_bd_pins rfsoc_data_pipeline_6/is_selected]
connect_bd_net [get_bd_pins channel_select_0/ch2] [get_bd_pins rfsoc_data_pipeline_2/is_selected]
connect_bd_net [get_bd_pins channel_select_0/ch0] [get_bd_pins rfsoc_data_pipeline_0/is_selected]
connect_bd_net [get_bd_pins channel_select_0/ch12] [get_bd_pins rfsoc_data_pipeline_12/is_selected]
connect_bd_net [get_bd_pins channel_select_0/ch11] [get_bd_pins rfsoc_data_pipeline_11/is_selected]
connect_bd_net [get_bd_pins channel_select_0/ch8] [get_bd_pins rfsoc_data_pipeline_8/is_selected]
connect_bd_net [get_bd_pins channel_select_0/ch1] [get_bd_pins rfsoc_data_pipeline_1/is_selected]
connect_bd_net [get_bd_pins trigger_controller_0/trigger_c0] [get_bd_pins rfsoc_data_pipeline_0/ext_trigger]
connect_bd_net [get_bd_pins trigger_controller_0/trigger_c1] [get_bd_pins rfsoc_data_pipeline_1/ext_trigger]
connect_bd_net [get_bd_pins trigger_controller_0/trigger_c2] [get_bd_pins rfsoc_data_pipeline_2/ext_trigger]
connect_bd_net [get_bd_pins trigger_controller_0/trigger_c3] [get_bd_pins rfsoc_data_pipeline_3/ext_trigger]
connect_bd_net -net ext_trigger_0_0_1 [get_bd_ports ext_trigger_0_0] [get_bd_pins trigger_controller_0/ext_trigger_in]
connect_bd_net [get_bd_pins rfsoc_data_pipeline_2/pipeline_active] [get_bd_pins trigger_controller_0/pipeline_active_in_2]
connect_bd_net [get_bd_pins rfsoc_data_pipeline_3/pipeline_active] [get_bd_pins trigger_controller_0/pipeline_active_in_3]
connect_bd_net [get_bd_pins rfsoc_data_pipeline_10/pipeline_active] [get_bd_pins trigger_controller_0/pipeline_active_in_10]
connect_bd_net [get_bd_pins rfsoc_data_pipeline_11/pipeline_active] [get_bd_pins trigger_controller_0/pipeline_active_in_11]
connect_bd_net [get_bd_pins trigger_controller_0/trigger_c11] [get_bd_pins rfsoc_data_pipeline_11/ext_trigger]
connect_bd_net [get_bd_pins trigger_controller_0/trigger_c10] [get_bd_pins rfsoc_data_pipeline_10/ext_trigger]
connect_bd_net [get_bd_pins trigger_controller_0/trigger_c9] \
  [get_bd_pins rfsoc_data_pipeline_9/ext_trigger] [get_bd_pins rfsoc_adc_data_captu_0/ext_trigger]
connect_bd_net [get_bd_pins trigger_controller_0/trigger_c8] [get_bd_pins rfsoc_data_pipeline_8/ext_trigger]
connect_bd_net [get_bd_pins rfsoc_data_pipeline_8/pipeline_active] [get_bd_pins trigger_controller_0/pipeline_active_in_8]
connect_bd_net [get_bd_pins rfsoc_data_pipeline_9/pipeline_active] [get_bd_pins trigger_controller_0/pipeline_active_in_9]
connect_bd_net [get_bd_pins rfsoc_data_pipeline_7/pipeline_active] [get_bd_pins trigger_controller_0/pipeline_active_in_7]
connect_bd_net [get_bd_pins trigger_controller_0/trigger_c7] [get_bd_pins rfsoc_data_pipeline_7/ext_trigger]
connect_bd_net [get_bd_pins trigger_controller_0/trigger_c6] [get_bd_pins rfsoc_data_pipeline_6/ext_trigger]
connect_bd_net [get_bd_pins rfsoc_data_pipeline_6/pipeline_active] [get_bd_pins trigger_controller_0/pipeline_active_in_6]
connect_bd_net [get_bd_pins trigger_controller_0/trigger_c5] [get_bd_pins rfsoc_data_pipeline_5/ext_trigger]
connect_bd_net [get_bd_pins rfsoc_data_pipeline_5/pipeline_active] [get_bd_pins trigger_controller_0/pipeline_active_in_5]
connect_bd_net [get_bd_pins rfsoc_data_pipeline_4/pipeline_active] [get_bd_pins trigger_controller_0/pipeline_active_in_4]
connect_bd_net [get_bd_pins trigger_controller_0/trigger_c4] [get_bd_pins rfsoc_data_pipeline_4/ext_trigger]
connect_bd_net [get_bd_pins trigger_controller_0/trigger_c15] [get_bd_pins rfsoc_data_pipeline_15/ext_trigger]
connect_bd_net [get_bd_pins rfsoc_data_pipeline_15/pipeline_active] [get_bd_pins trigger_controller_0/pipeline_active_in_15]
connect_bd_net [get_bd_pins trigger_controller_0/trigger_c14] [get_bd_pins rfsoc_data_pipeline_14/ext_trigger]
connect_bd_net [get_bd_pins rfsoc_data_pipeline_14/pipeline_active] [get_bd_pins trigger_controller_0/pipeline_active_in_14]
connect_bd_net [get_bd_pins trigger_controller_0/trigger_c13] [get_bd_pins rfsoc_data_pipeline_13/ext_trigger]
connect_bd_net [get_bd_pins rfsoc_data_pipeline_13/pipeline_active] [get_bd_pins trigger_controller_0/pipeline_active_in_13]
connect_bd_net [get_bd_pins trigger_controller_0/trigger_c12] [get_bd_pins rfsoc_data_pipeline_12/ext_trigger]
connect_bd_net [get_bd_pins rfsoc_data_pipeline_12/pipeline_active] [get_bd_pins trigger_controller_0/pipeline_active_in_12]
connect_bd_net [get_bd_pins usp_rf_data_converter_0/clk_adc0] \
  [get_bd_pins usp_rf_data_converter_0/m0_axis_aclk] [get_bd_pins proc_sys_reset_4/slowest_sync_clk] \
  [get_bd_pins rfsoc_adc_data_captu_0/rf_clk]
connect_bd_net [get_bd_pins proc_sys_reset_4/peripheral_aresetn] \
  [get_bd_pins usp_rf_data_converter_0/m0_axis_aresetn] [get_bd_pins rfsoc_adc_data_captu_0/rf_reset]
set_property HDL_ATTRIBUTE.BMM_INFO_PROCESSOR {microblaze-le > top_level microblaze_0_local_memory/dlmb_bram_if_cntlr} [get_bd_cells microblaze_0]
set_property HDL_ATTRIBUTE.KEEP_HIERARCHY yes [get_bd_cells microblaze_0]

# ---- address map ----
assign_bd_address -offset 0x00000000 -range 512K -target_address_space [get_bd_addr_spaces microblaze_0/Data] [get_bd_addr_segs microblaze_0_local_memory/dlmb_bram_if_cntlr/SLMB/Mem]
assign_bd_address -offset 0x40000000 -range 64K -target_address_space [get_bd_addr_spaces microblaze_0/Data] [get_bd_addr_segs axi_gpio_0/S_AXI/Reg]
assign_bd_address -offset 0x40600000 -range 64K -target_address_space [get_bd_addr_spaces microblaze_0/Data] [get_bd_addr_segs axi_uartlite_0/S_AXI/Reg]
assign_bd_address -offset 0x41400000 -range 4K -target_address_space [get_bd_addr_spaces microblaze_0/Data] [get_bd_addr_segs mdm_1/S_AXI/Reg]
assign_bd_address -offset 0x44A00000 -range 256K -target_address_space [get_bd_addr_spaces microblaze_0/Data] [get_bd_addr_segs usp_rf_data_converter_0/s_axi/Reg]
assign_bd_address -offset 0x00000000 -range 512K -target_address_space [get_bd_addr_spaces microblaze_0/Instruction] [get_bd_addr_segs microblaze_0_local_memory/ilmb_bram_if_cntlr/SLMB/Mem]

validate_bd_design
save_bd_design
